# Altium schematic sheet STM32F105RBT6.SchDoc
size A2
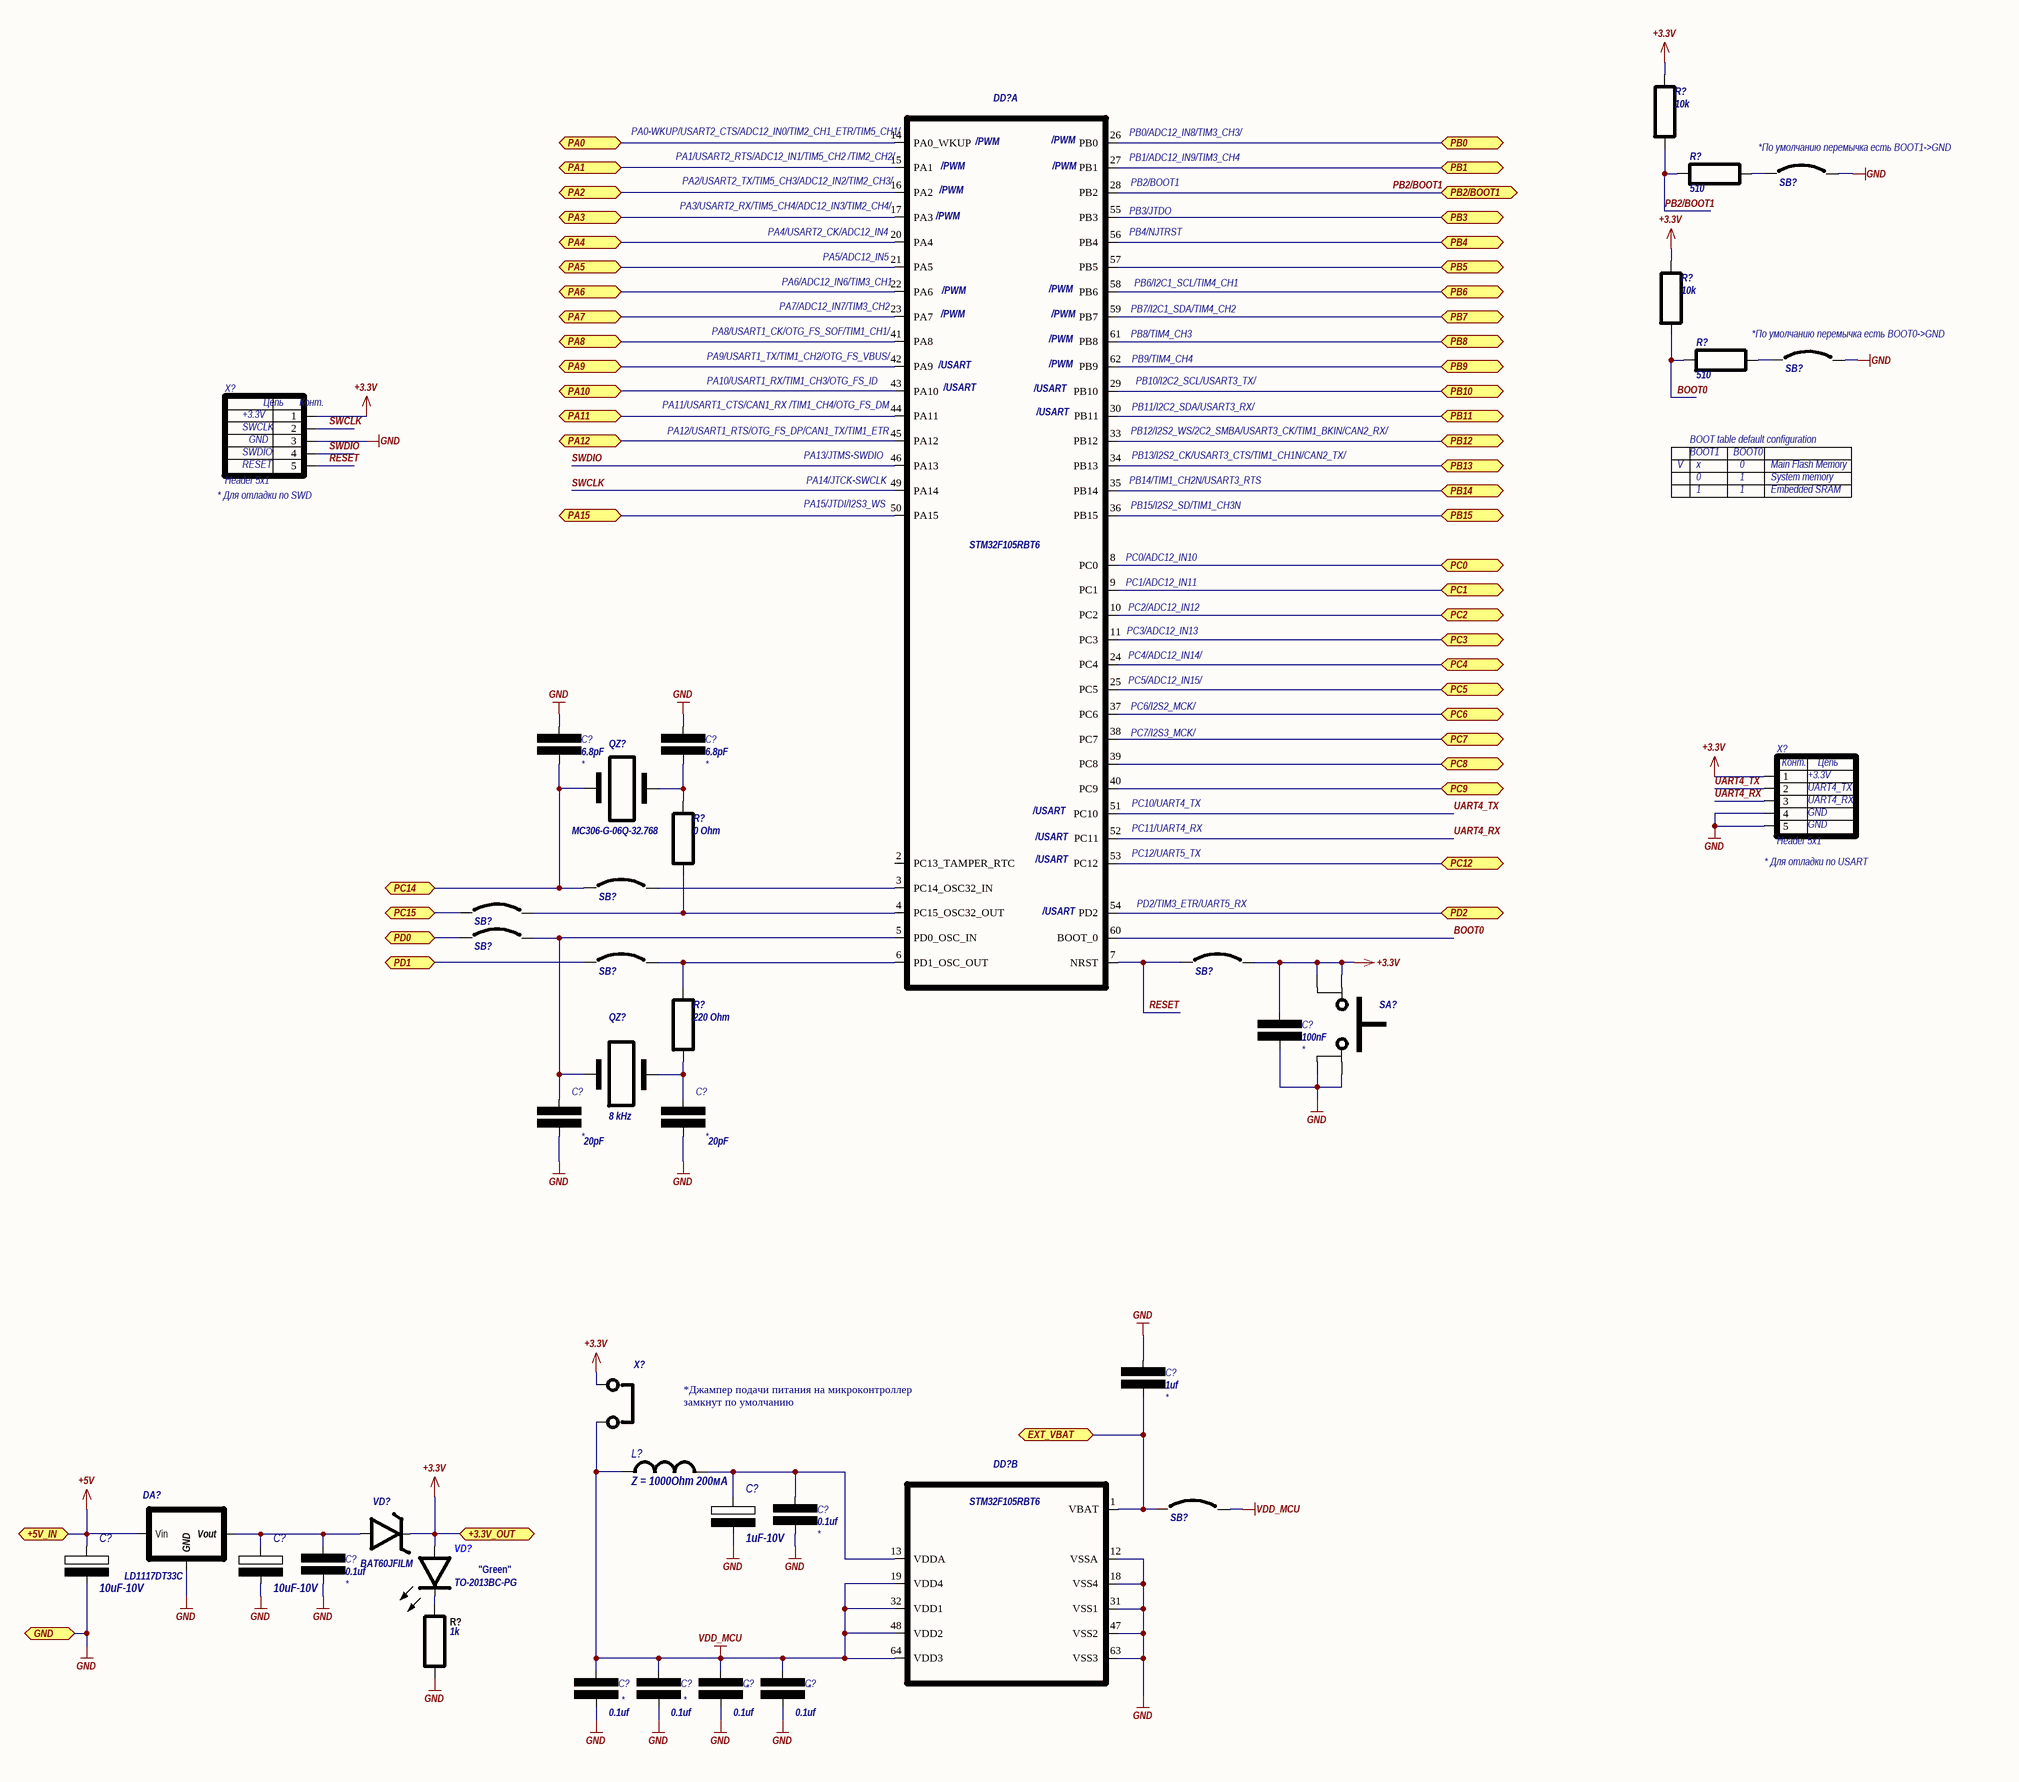
[diagram p0: STM32F105RBT6.SchDoc]

## Parts
(Parts that share a designator on the sheet are numbered #1, #2 ... from top to bottom, then left to right.)
C?#1  6.8pF  [C0603]
C?#2  6.8pF  [C0603]
C?#3  100nF  [C0603]
C?#4  20pF  [C0603]
C?#5  20pF  [C0603]
C?#6  1uf  [C0603]
C?#7  1uF-10V  [C1206_CaseA_Tant]
C?#8  0.1uf  [C0603]
C?#9  10uF-10V  [C1206_CaseA_Tant]
C?#10  10uF-10V  [C1206_CaseA_Tant]
C?#11  0.1uf  [C0603]
C?#12  0.1uf  [C0603]
C?#13  0.1uf  [C0603]
C?#14  0.1uf  [C0603]
C?#15  0.1uf  [C0603]
DA?  man: LD1117DT33C  [DPAK]  (hidden comment: LD1117)
DD?#1  STM32F105RBT6  [LQFP64_L]  (part A of 2)
DD?#2  STM32F105RBT6  [LQFP64_L]  (part B of 2)
L?  Z = 1000Ohm 200мА  [R0603]
QZ?#1  value MC306-G-06Q-32.768  [MC-306]  (hidden comment: Quarz_32768_4pin)
QZ?#2  value 8 kHz  [HC-49S]  (hidden comment: QARZ_OSCILLATOR)
R?#1  10k  [R0603]
R?#2  510  [R0603]
R?#3  10k  [R0603]
R?#4  510  [R0603]
R?#5  0 Ohm  [R0603]
R?#6  220 Ohm  [R0603]
R?#7  1k  [R0805]
SA?  BUTTON_4PIN_SMD  [BUTTON_SMD_4PIN]  (value not drawn)
SB?#1  SB  [SB0603]  (value not drawn)
SB?#2  SB  [SB0603]  (value not drawn)
SB?#3  SB  [SB0603]  (value not drawn)
SB?#4  SB  [SB0603]  (value not drawn)
SB?#5  SB  [SB0603]  (value not drawn)
SB?#6  SB  [SB0603]  (value not drawn)
SB?#7  SB  [SB0603]  (value not drawn)
SB?#8  SB  [SB0603]  (value not drawn)
VD?#1  BAT60JFILM  [SOD323]
VD?#2  value TO-2013BC-PG  [led0805]  (hidden comment: LED_0805)
X?#1  Header 5x1  [HDR1X5]
X?#2  Header 5x1  [HDR1X5]
X?#3  JUMPER  [JUMPER]  (value not drawn)

## Ports
+3.3V_OUT, +5V_IN, EXT_VBAT, GND, PA0, PA1, PA2, PA3, PA4, PA5, PA6, PA7, PA8, PA9, PA10, PA11, PA12, PA15, PB0, PB1, PB2/BOOT1, PB3, PB4, PB5, PB6, PB7, PB8, PB9, PB10, PB11, PB12, PB13, PB14, PB15, PC0, PC1, PC2, PC3, PC4, PC5, PC6, PC7, PC8, PC9, PC12, PC14, PC15, PD0, PD1, PD2

## Nets
+3.3V: C?#3.2 R?#1.1 R?#3.1 SA?.1 SA?.2 SB?#7.2 VD?#1.2(katode) VD?#2.2(A) X?#1.1 X?#2.1 X?#3.1 ; port +3.3V_OUT
+5V: C?#9.1(P) DA?.1(Vin) ; port +5V_IN
GND: C?#1.2 C?#2.2 C?#3.1 C?#4.1 C?#5.1 C?#6.2 C?#7.2(M) C?#8.1 C?#9.2(M) C?#10.2(M) C?#11.1 C?#12.1 C?#13.1 C?#14.1 C?#15.1 DA?.2(GND) DD?#2.12(VSSA) DD?#2.18(VSS4) DD?#2.31(VSS1) DD?#2.47(VSS2) DD?#2.63(VSS3) R?#7.1 SA?.3 SA?.4 SB?#1.2 SB?#2.2 X?#1.3 X?#2.4 X?#2.5 ; port GND
VDD_MCU: C?#12.2 C?#13.2 C?#14.2 C?#15.2 DD?#2.19(VDD4) DD?#2.32(VDD1) DD?#2.48(VDD2) DD?#2.64(VDD3) L?.1 SB?#8.2 X?#3.2
BOOT0: DD?#1.60(BOOT_0) R?#3.2 R?#4.1
EXT_VBAT: C?#6.1 DD?#2.1(VBAT) SB?#8.1 ; port EXT_VBAT
PA0: DD?#1.14(PA0_WKUP) ; port PA0
PA1: DD?#1.15(PA1) ; port PA1
PA2: DD?#1.16(PA2) ; port PA2
PA3: DD?#1.17(PA3) ; port PA3
PA4: DD?#1.20(PA4) ; port PA4
PA5: DD?#1.21(PA5) ; port PA5
PA6: DD?#1.22(PA6) ; port PA6
PA7: DD?#1.23(PA7) ; port PA7
PA8: DD?#1.41(PA8) ; port PA8
PA9: DD?#1.42(PA9) ; port PA9
PA10: DD?#1.43(PA10) ; port PA10
PA11: DD?#1.44(PA11) ; port PA11
PA12: DD?#1.45(PA12) ; port PA12
PA15: DD?#1.50(PA15) ; port PA15
PB0: DD?#1.26(PB0) ; port PB0
PB1: DD?#1.27(PB1) ; port PB1
PB2/BOOT1: DD?#1.28(PB2) R?#1.2 R?#2.1 ; port PB2/BOOT1
PB3: DD?#1.55(PB3) ; port PB3
PB4: DD?#1.56(PB4) ; port PB4
PB5: DD?#1.57(PB5) ; port PB5
PB6: DD?#1.58(PB6) ; port PB6
PB7: DD?#1.59(PB7) ; port PB7
PB8: DD?#1.61(PB8) ; port PB8
PB9: DD?#1.62(PB9) ; port PB9
PB10: DD?#1.29(PB10) ; port PB10
PB11: DD?#1.30(PB11) ; port PB11
PB12: DD?#1.33(PB12) ; port PB12
PB13: DD?#1.34(PB13) ; port PB13
PB14: DD?#1.35(PB14) ; port PB14
PB15: DD?#1.36(PB15) ; port PB15
PC0: DD?#1.8(PC0) ; port PC0
PC1: DD?#1.9(PC1) ; port PC1
PC2: DD?#1.10(PC2) ; port PC2
PC3: DD?#1.11(PC3) ; port PC3
PC4: DD?#1.24(PC4) ; port PC4
PC5: DD?#1.25(PC5) ; port PC5
PC6: DD?#1.37(PC6) ; port PC6
PC7: DD?#1.38(PC7) ; port PC7
PC8: DD?#1.39(PC8) ; port PC8
PC9: DD?#1.40(PC9) ; port PC9
PC12: DD?#1.53(PC12) ; port PC12
PC14: C?#1.1 QZ?#1.1(S1) SB?#3.1 ; port PC14
PC15: SB?#4.1 ; port PC15
PD0: SB?#5.1 ; port PD0
PD1: SB?#6.1 ; port PD1
PD2: DD?#1.54(PD2) ; port PD2
RESET: DD?#1.7(NRST) SB?#7.1 X?#1.5
SWCLK: DD?#1.49(PA14) X?#1.2
SWDIO: DD?#1.46(PA13) X?#1.4
UART4_RX: DD?#1.52(PC11) X?#2.3
UART4_TX: DD?#1.51(PC10) X?#2.2
NetC?#2_1: C?#2.1 QZ?#1.4(S4) R?#5.2
NetC?#4_2: C?#4.2 DD?#1.5(PD0_OSC_IN) QZ?#2.1 SB?#5.2
NetC?#5_2: C?#5.2 QZ?#2.2 R?#6.1
NetC?#7_1: C?#7.1(P) C?#8.2 DD?#2.13(VDDA) L?.2
NetC?#10_1: C?#10.1(P) C?#11.2 DA?.3(Vout) VD?#1.1(anode)
NetDD?#1_3: DD?#1.3(PC14_OSC32_IN) SB?#3.2
NetDD?#1_4: DD?#1.4(PC15_OSC32_OUT) R?#5.1 SB?#4.2
NetDD?#1_6: DD?#1.6(PD1_OSC_OUT) R?#6.2 SB?#6.2
NetR?#2_2: R?#2.2 SB?#1.1
NetR?#4_2: R?#4.2 SB?#2.1
NetR?#7_2: R?#7.2 VD?#2.1(K)

Not connected (* = marked no-connect by the designer): DD?#1 2(PC13_TAMPER_RTC); QZ?#1 3(S3)

## Notes on the sheet
- (near DD?#1) PA0-WKUP/USART2_CTS/ADC12_IN0/TIM2_CH1_ETR/TIM5_CH1/
- (near DD?#1) PA1/USART2_RTS/ADC12_IN1/TIM5_CH2 /TIM2_CH2/
- (near DD?#1) PA2/USART2_TX/TIM5_CH3/ADC12_IN2/TIM2_CH3/
- (near DD?#1) /PWM
- (near DD?#1) PB0/ADC12_IN8/TIM3_CH3/
- (near DD?#1) PB1/ADC12_IN9/TIM3_CH4
- (near DD?#1) PB2/BOOT1
- *По умолчанию перемычка есть BOOT1->GND
- (near DD?#1) PA3/USART2_RX/TIM5_CH4/ADC12_IN3/TIM2_CH4/
- (near DD?#1) PA4/USART2_CK/ADC12_IN4
- (near DD?#1) PB3/JTDO
- (near DD?#1) PB4/NJTRST
- (near DD?#1) PA7/ADC12_IN7/TIM3_CH2
- (near DD?#1) PA6/ADC12_IN6/TIM3_CH1
- (near DD?#1) PA5/ADC12_IN5
- (near DD?#1) PB7/I2C1_SDA/TIM4_CH2
- (near DD?#1) PB6/I2C1_SCL/TIM4_CH1
- (near DD?#1) PA9/USART1_TX/TIM1_CH2/OTG_FS_VBUS/
- (near DD?#1) PA8/USART1_CK/OTG_FS_SOF/TIM1_CH1/
- (near DD?#1) /USART
- (near DD?#1) PB8/TIM4_CH3
- (near DD?#1) PB9/TIM4_CH4
- *По умолчанию перемычка есть BOOT0->GND
- (near X?#1) +3.3V
- (near X?#1) SWCLK
- (near X?#1) GND
- (near DD?#1) PA11/USART1_CTS/CAN1_RX /TIM1_CH4/OTG_FS_DM
- (near DD?#1) PA12/USART1_RTS/OTG_FS_DP/CAN1_TX/TIM1_ETR
- (near DD?#1) PA10/USART1_RX/TIM1_CH3/OTG_FS_ID
- (near DD?#1) PB12/I2S2_WS/2C2_SMBA/USART3_CK/TIM1_BKIN/CAN2_RX/
- (near DD?#1) PB11/I2C2_SDA/USART3_RX/
- (near DD?#1) PB10/I2C2_SCL/USART3_TX/
- BOOT table default configuration
- (near X?#1) * Для отладки по SWD
- (near X?#1) SWDIO
- (near X?#1) RESET
- (near DD?#1) PA13/JTMS-SWDIO
- (near DD?#1) PA14/JTCK-SWCLK
- (near DD?#1) PB14/TIM1_CH2N/USART3_RTS
- (near DD?#1) PB13/I2S2_CK/USART3_CTS/TIM1_CH1N/CAN2_TX/
- V
- BOOT1
- x
- 0
- 1
- BOOT0
- Main Flash Memory
- System memory
- Embedded SRAM
- (near DD?#1) PA15/JTDI/I2S3_WS
- (near DD?#1) PC0/ADC12_IN10
- (near DD?#1) PB15/I2S2_SD/TIM1_CH3N
- (near DD?#1) PC1/ADC12_IN11
- (near DD?#1) PC2/ADC12_IN12
- (near DD?#1) PC3/ADC12_IN13
- (near DD?#1) PC4/ADC12_IN14/
- (near DD?#1) PC5/ADC12_IN15/
- (near DD?#1) PC6/I2S2_MCK/
- (near DD?#1) PC7/I2S3_MCK/
- (near DD?#1) PC10/UART4_TX
- (near X?#2) +3.3V
- (near X?#2) GND
- (near X?#2) UART4_TX
- (near X?#2) UART4_RX
- (near DD?#1) PC11/UART4_RX
- (near DD?#1) PC12/UART5_TX
- (near X?#2) * Для отладки по USART
- (near DD?#1) PD2/TIM3_ETR/UART5_RX
- *Джампер подачи питания на микроконтроллер
- замкнут по умолчанию
- (near VD?#2) "Green"
- (in symbol Header 5x1) Цепь; Конт.

## Library data of the parts
C?#1-C?#6 C?#8 C?#11-C?#15 = Capacitor: fab: *
  C?#1 C?#2: Value: 6.8pF
  C?#3: Value: 100nF
  C?#4 C?#5: Value: 20pF
  C?#6: Value: 1uf
  C?#8 C?#11-C?#15: Value: 0.1uf
C?#7 C?#9 C?#10 = Capacitor Tantalum: =Value; DEV: CPS_3216_01; FAB: AVX; TEMP: -55°C а 125°C; BOI: A; DESIG: LOW ESR TANTALUM CAPACITOR; TOL: 10%; REF: TPSA106K010R1800
  C?#7: Value: 1uF-10V
  C?#9 C?#10: Value: 10uF-10V
DD?#1 DD?#2 = STM32F105RBT6: Connectivity line, ARM®-based 32-bit MCU with 128 KB Flash, USB  OTG, 10 timers, 2 CANs, 2 ADCs, 14 communication interfaces; Value: *
L? = L: Inductor; Code_IEC: 1005; Published: 8-Jun-2000; LatestRevisionDate: 29-May-2009; LatestRevisionNote: IPC-7351 Footprint Added.; PackageReference: 0402-A; Publisher: Altium Limited; PackageDescription: Chip Inductor; Code_JEITA: 0402; Value: Z = 1000Ohm 200мА
QZ?#1 = Quarz_32768_4pin: QZ_32768HZ
R?#1-R?#6 = R: SMD resistor
  R?#1 R?#3: Value: 10k
  R?#2 R?#4: Value: 510
  R?#5: Value: 0 Ohm
  R?#6: Value: 220 Ohm
R?#7 = Resistor_russian: Resistor; Value: 1k
VD?#1 = BAT60J: SMALL SIGNAL SCHOTTKY DIODE  10V 3A; Value: {Value}
SA? = BUTTON_4PIN_SMD: Value: *
X?#3 = JUMPER: Value: *